# Altium project dankboard.PrjPcb
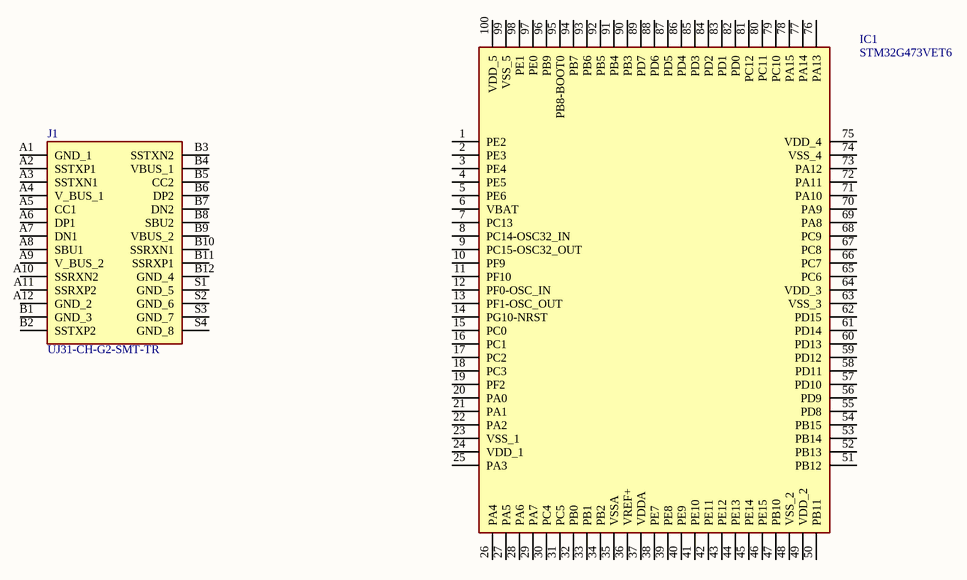
[diagram p0: dankboard.SchDoc]
3 sheets, 254 parts. Net scope: global (net labels, ports and power ports of the same name join across sheets).
Board file: dankboard.PcbDoc
Sheets:
  dankboard.SchDoc
  matrix.SchDoc
  rgb.SchDoc

## Sheet dankboard.SchDoc: dankboard - microcontroller
size A4; Author: Alexander Cafarella; CompanyName: Dank; DrawnBy: Alexander Cafarella; Engineer: Alexander Cafarella; SheetNumber: 1; SheetTotal: 3

### Parts
IC1  STM32G473VET6  [QFP50P1600X1600X160-100N]
J1  UJ31-CH-G2-SMT-TR  [UJ31CHG2SMTTR]

### Nets

Not connected (* = marked no-connect by the designer): IC1 1(PE2) 2(PE3) 3(PE4) 4(PE5) 5(PE6) 6(VBAT) 7(PC13) 8(PC14-OSC32_IN) 9(PC15-OSC32_OUT) 10(PF9) 11(PF10) 12(PF0-OSC_IN) 13(PF1-OSC_OUT) 14(PG10-NRST) 15(PC0) 16(PC1) 17(PC2) 18(PC3) 19(PF2) 20(PA0) 21(PA1) 22(PA2) 23(VSS_1) 24(VDD_1) 25(PA3) 26(PA4) 27(PA5) 28(PA6) 29(PA7) 30(PC4) 31(PC5) 32(PB0) 33(PB1) 34(PB2) 35(VSSA) 36(VREF+) 37(VDDA) 38(PE7) 39(PE8) 40(PE9) 41(PE10) 42(PE11) 43(PE12) 44(PE13) 45(PE14) 46(PE15) 47(PB10) 48(VSS_2) 49(VDD_2) 50(PB11) 51(PB12) 52(PB13) 53(PB14) 54(PB15) 55(PD8) 56(PD9) 57(PD10) 58(PD11) 59(PD12) 60(PD13) 61(PD14) 62(PD15) 63(VSS_3) 64(VDD_3) 65(PC6) 66(PC7) 67(PC8) 68(PC9) 69(PA8) 70(PA9) 71(PA10) 72(PA11) 73(PA12) 74(VSS_4) 75(VDD_4) 76(PA13) 77(PA14) 78(PA15) 79(PC10) 80(PC11) 81(PC12) 82(PD0) 83(PD1) 84(PD2) 85(PD3) 86(PD4) 87(PD5) 88(PD6) 89(PD7) 90(PB3) 91(PB4) 92(PB5) 93(PB6) 94(PB7) 95(PB8-BOOT0) 96(PB9) 97(PE0) 98(PE1) 99(VSS_5) 100(VDD_5); J1 A1(GND_1) A2(SSTXP1) A3(SSTXN1) A4(V_BUS_1) A5(CC1) A6(DP1) A7(DN1) A8(SBU1) A9(V_BUS_2) A10(SSRXN2) A11(SSRXP2) A12(GND_2) B1(GND_3) B2(SSTXP2) B3(SSTXN2) B4(VBUS_1) B5(CC2) B6(DP2) B7(DN2) B8(SBU2) B9(VBUS_2) B10(SSRXN1) B11(SSRXP1) B12(GND_4) S1(GND_5) S2(GND_6) S3(GND_7) S4(GND_8)

### Library data of the parts
IC1 = STM32G473VET6: Integrated Circuit; Manufacturer_Name: STMicroelectronics; Datasheet Link: https://www.st.com/resource/en/datasheet/stm32g473cb.pdf; Height: 1.6mm; Manufacturer_Part_Number: STM32G473VET6; Mouser Part Number: 511-STM32G473VET6; Mouser Price/Stock: https://www.mouser.co.uk/ProductDetail/STMicroelectronics/STM32G473VET6?qs=PzGy0jfpSMuOfCPr1WW9ZQ%3D%3D
J1 = UJ31-CH-G2-SMT-TR: Connector; Manufacturer_Name: CUI Devices; Datasheet Link: https://www.arrow.com/en/products/uj31-ch-g2-smt-tr/cui-devices; Height: 4.66mm; Manufacturer_Part_Number: UJ31-CH-G2-SMT-TR; Arrow Part Number: UJ31-CH-G2-SMT-TR; Arrow Price/Stock: https://www.arrow.com/en/products/uj31-ch-g2-smt-tr/cui-devices; Mouser Part Number: 490-UJ31-CH-G2SMT-TR; Mouser Price/Stock: https://www.mouser.co.uk/ProductDetail/CUI-Devices/UJ31-CH-G2-SMT-TR?qs=W0yvOO0ixfGEsh2EYrPgIQ%3D%3D

## Sheet matrix.SchDoc: Dankboard - Key Matrix
size 660 x 279 mm; Author: Alexander Cafarella; CompanyName: Dank; DrawnBy: Alexander Cafarella; Engineer: Alexander Cafarella; Organization: Dank; SheetNumber: 2; SheetTotal: 3
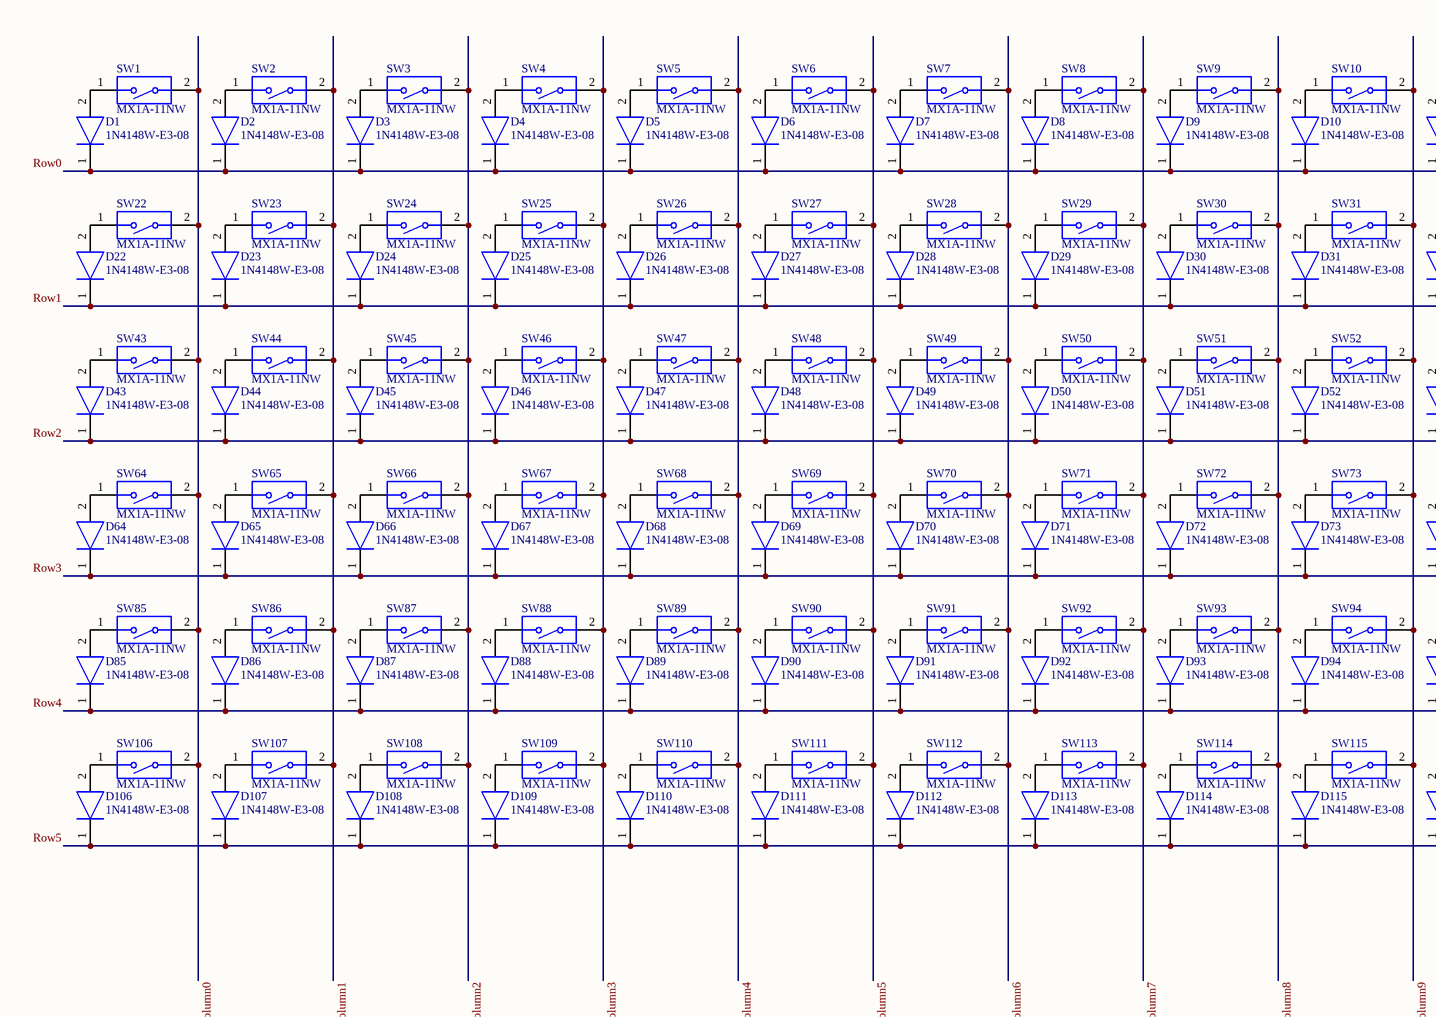
[diagram p1: matrix.SchDoc, left]
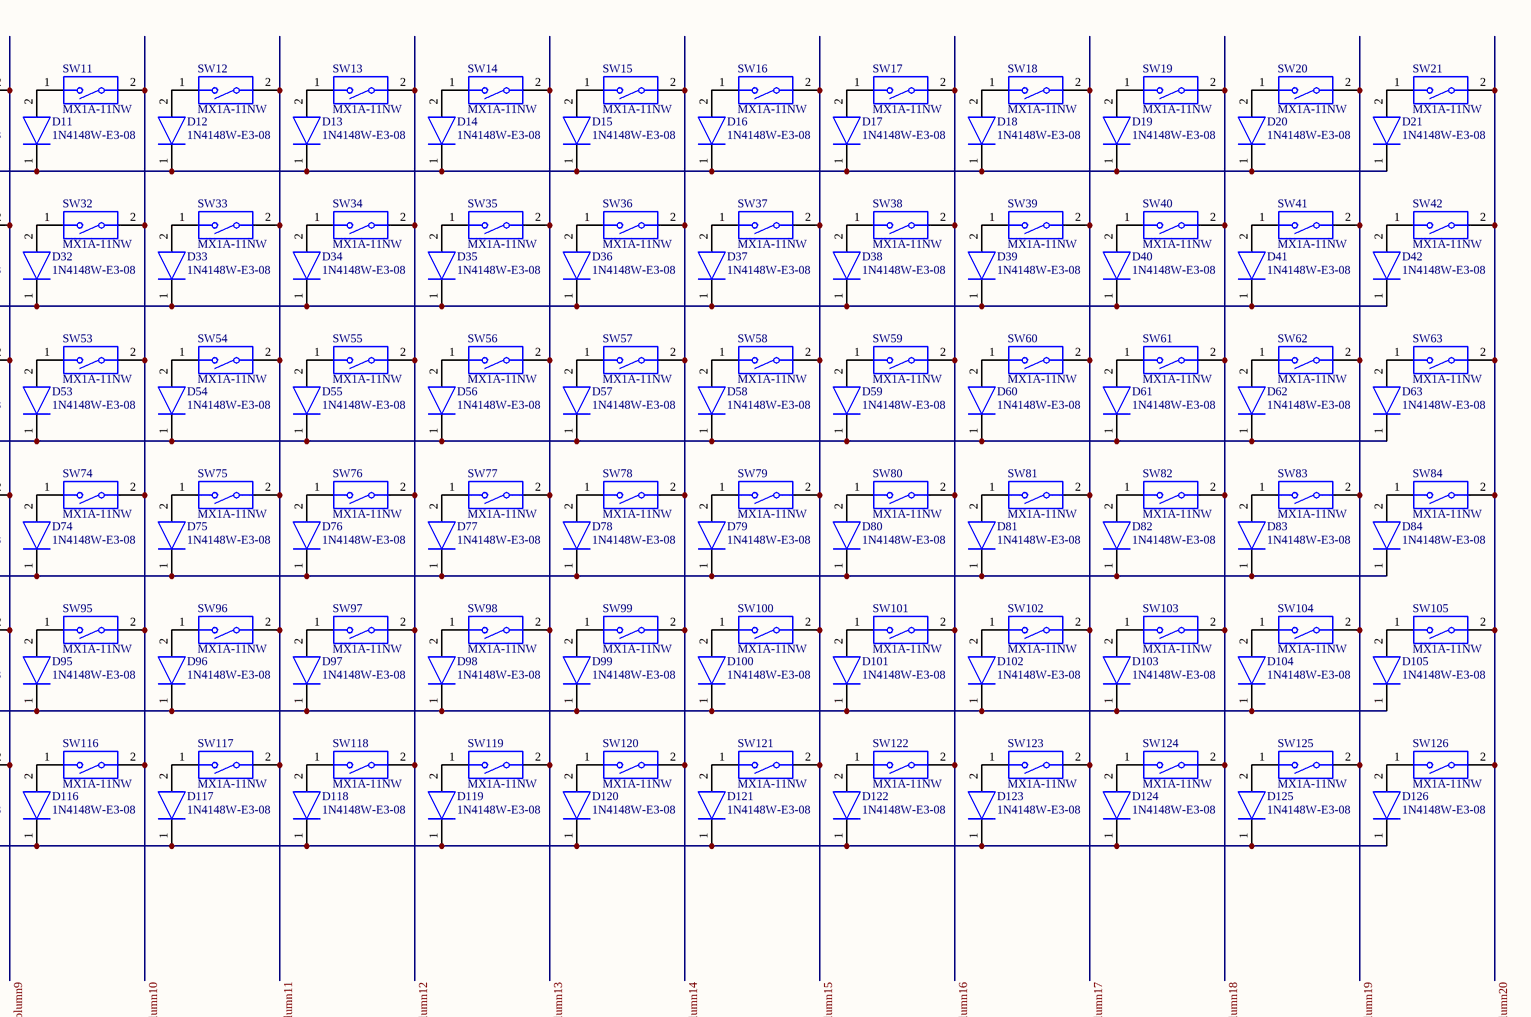
[diagram p2: matrix.SchDoc, right]

### Parts
D1  1N4148W-E3-08  [SOD3716X135N]
D2  1N4148W-E3-08  [SOD3716X135N]
D3  1N4148W-E3-08  [SOD3716X135N]
D4  1N4148W-E3-08  [SOD3716X135N]
D5  1N4148W-E3-08  [SOD3716X135N]
D6  1N4148W-E3-08  [SOD3716X135N]
D7  1N4148W-E3-08  [SOD3716X135N]
D8  1N4148W-E3-08  [SOD3716X135N]
D9  1N4148W-E3-08  [SOD3716X135N]
D10  1N4148W-E3-08  [SOD3716X135N]
D11  1N4148W-E3-08  [SOD3716X135N]
D12  1N4148W-E3-08  [SOD3716X135N]
D13  1N4148W-E3-08  [SOD3716X135N]
D14  1N4148W-E3-08  [SOD3716X135N]
D15  1N4148W-E3-08  [SOD3716X135N]
D16  1N4148W-E3-08  [SOD3716X135N]
D17  1N4148W-E3-08  [SOD3716X135N]
D18  1N4148W-E3-08  [SOD3716X135N]
D19  1N4148W-E3-08  [SOD3716X135N]
D20  1N4148W-E3-08  [SOD3716X135N]
D21  1N4148W-E3-08  [SOD3716X135N]
D22  1N4148W-E3-08  [SOD3716X135N]
D23  1N4148W-E3-08  [SOD3716X135N]
D24  1N4148W-E3-08  [SOD3716X135N]
D25  1N4148W-E3-08  [SOD3716X135N]
D26  1N4148W-E3-08  [SOD3716X135N]
D27  1N4148W-E3-08  [SOD3716X135N]
D28  1N4148W-E3-08  [SOD3716X135N]
D29  1N4148W-E3-08  [SOD3716X135N]
D30  1N4148W-E3-08  [SOD3716X135N]
D31  1N4148W-E3-08  [SOD3716X135N]
D32  1N4148W-E3-08  [SOD3716X135N]
D33  1N4148W-E3-08  [SOD3716X135N]
D34  1N4148W-E3-08  [SOD3716X135N]
D35  1N4148W-E3-08  [SOD3716X135N]
D36  1N4148W-E3-08  [SOD3716X135N]
D37  1N4148W-E3-08  [SOD3716X135N]
D38  1N4148W-E3-08  [SOD3716X135N]
D39  1N4148W-E3-08  [SOD3716X135N]
D40  1N4148W-E3-08  [SOD3716X135N]
D41  1N4148W-E3-08  [SOD3716X135N]
D42  1N4148W-E3-08  [SOD3716X135N]
D43  1N4148W-E3-08  [SOD3716X135N]
D44  1N4148W-E3-08  [SOD3716X135N]
D45  1N4148W-E3-08  [SOD3716X135N]
D46  1N4148W-E3-08  [SOD3716X135N]
D47  1N4148W-E3-08  [SOD3716X135N]
D48  1N4148W-E3-08  [SOD3716X135N]
D49  1N4148W-E3-08  [SOD3716X135N]
D50  1N4148W-E3-08  [SOD3716X135N]
D51  1N4148W-E3-08  [SOD3716X135N]
D52  1N4148W-E3-08  [SOD3716X135N]
D53  1N4148W-E3-08  [SOD3716X135N]
D54  1N4148W-E3-08  [SOD3716X135N]
D55  1N4148W-E3-08  [SOD3716X135N]
D56  1N4148W-E3-08  [SOD3716X135N]
D57  1N4148W-E3-08  [SOD3716X135N]
D58  1N4148W-E3-08  [SOD3716X135N]
D59  1N4148W-E3-08  [SOD3716X135N]
D60  1N4148W-E3-08  [SOD3716X135N]
D61  1N4148W-E3-08  [SOD3716X135N]
D62  1N4148W-E3-08  [SOD3716X135N]
D63  1N4148W-E3-08  [SOD3716X135N]
D64  1N4148W-E3-08  [SOD3716X135N]
D65  1N4148W-E3-08  [SOD3716X135N]
D66  1N4148W-E3-08  [SOD3716X135N]
D67  1N4148W-E3-08  [SOD3716X135N]
D68  1N4148W-E3-08  [SOD3716X135N]
D69  1N4148W-E3-08  [SOD3716X135N]
D70  1N4148W-E3-08  [SOD3716X135N]
D71  1N4148W-E3-08  [SOD3716X135N]
D72  1N4148W-E3-08  [SOD3716X135N]
D73  1N4148W-E3-08  [SOD3716X135N]
D74  1N4148W-E3-08  [SOD3716X135N]
D75  1N4148W-E3-08  [SOD3716X135N]
D76  1N4148W-E3-08  [SOD3716X135N]
D77  1N4148W-E3-08  [SOD3716X135N]
D78  1N4148W-E3-08  [SOD3716X135N]
D79  1N4148W-E3-08  [SOD3716X135N]
D80  1N4148W-E3-08  [SOD3716X135N]
D81  1N4148W-E3-08  [SOD3716X135N]
D82  1N4148W-E3-08  [SOD3716X135N]
D83  1N4148W-E3-08  [SOD3716X135N]
D84  1N4148W-E3-08  [SOD3716X135N]
D85  1N4148W-E3-08  [SOD3716X135N]
D86  1N4148W-E3-08  [SOD3716X135N]
D87  1N4148W-E3-08  [SOD3716X135N]
D88  1N4148W-E3-08  [SOD3716X135N]
D89  1N4148W-E3-08  [SOD3716X135N]
D90  1N4148W-E3-08  [SOD3716X135N]
D91  1N4148W-E3-08  [SOD3716X135N]
D92  1N4148W-E3-08  [SOD3716X135N]
D93  1N4148W-E3-08  [SOD3716X135N]
D94  1N4148W-E3-08  [SOD3716X135N]
D95  1N4148W-E3-08  [SOD3716X135N]
D96  1N4148W-E3-08  [SOD3716X135N]
D97  1N4148W-E3-08  [SOD3716X135N]
D98  1N4148W-E3-08  [SOD3716X135N]
D99  1N4148W-E3-08  [SOD3716X135N]
D100  1N4148W-E3-08  [SOD3716X135N]
D101  1N4148W-E3-08  [SOD3716X135N]
D102  1N4148W-E3-08  [SOD3716X135N]
D103  1N4148W-E3-08  [SOD3716X135N]
D104  1N4148W-E3-08  [SOD3716X135N]
D105  1N4148W-E3-08  [SOD3716X135N]
D106  1N4148W-E3-08  [SOD3716X135N]
D107  1N4148W-E3-08  [SOD3716X135N]
D108  1N4148W-E3-08  [SOD3716X135N]
D109  1N4148W-E3-08  [SOD3716X135N]
D110  1N4148W-E3-08  [SOD3716X135N]
D111  1N4148W-E3-08  [SOD3716X135N]
D112  1N4148W-E3-08  [SOD3716X135N]
D113  1N4148W-E3-08  [SOD3716X135N]
D114  1N4148W-E3-08  [SOD3716X135N]
D115  1N4148W-E3-08  [SOD3716X135N]
D116  1N4148W-E3-08  [SOD3716X135N]
D117  1N4148W-E3-08  [SOD3716X135N]
D118  1N4148W-E3-08  [SOD3716X135N]
D119  1N4148W-E3-08  [SOD3716X135N]
D120  1N4148W-E3-08  [SOD3716X135N]
D121  1N4148W-E3-08  [SOD3716X135N]
D122  1N4148W-E3-08  [SOD3716X135N]
D123  1N4148W-E3-08  [SOD3716X135N]
D124  1N4148W-E3-08  [SOD3716X135N]
D125  1N4148W-E3-08  [SOD3716X135N]
D126  1N4148W-E3-08  [SOD3716X135N]
SW1  MX1A-11NW  [CHRY-MX1A-11NW_V]
SW2  MX1A-11NW  [CHRY-MX1A-11NW_V]
SW3  MX1A-11NW  [CHRY-MX1A-11NW_V]
SW4  MX1A-11NW  [CHRY-MX1A-11NW_V]
SW5  MX1A-11NW  [CHRY-MX1A-11NW_V]
SW6  MX1A-11NW  [CHRY-MX1A-11NW_V]
SW7  MX1A-11NW  [CHRY-MX1A-11NW_V]
SW8  MX1A-11NW  [CHRY-MX1A-11NW_V]
SW9  MX1A-11NW  [CHRY-MX1A-11NW_V]
SW10  MX1A-11NW  [CHRY-MX1A-11NW_V]
SW11  MX1A-11NW  [CHRY-MX1A-11NW_V]
SW12  MX1A-11NW  [CHRY-MX1A-11NW_V]
SW13  MX1A-11NW  [CHRY-MX1A-11NW_V]
SW14  MX1A-11NW  [CHRY-MX1A-11NW_V]
SW15  MX1A-11NW  [CHRY-MX1A-11NW_V]
SW16  MX1A-11NW  [CHRY-MX1A-11NW_V]
SW17  MX1A-11NW  [CHRY-MX1A-11NW_V]
SW18  MX1A-11NW  [CHRY-MX1A-11NW_V]
SW19  MX1A-11NW  [CHRY-MX1A-11NW_V]
SW20  MX1A-11NW  [CHRY-MX1A-11NW_V]
SW21  MX1A-11NW  [CHRY-MX1A-11NW_V]
SW22  MX1A-11NW  [CHRY-MX1A-11NW_V]
SW23  MX1A-11NW  [CHRY-MX1A-11NW_V]
SW24  MX1A-11NW  [CHRY-MX1A-11NW_V]
SW25  MX1A-11NW  [CHRY-MX1A-11NW_V]
SW26  MX1A-11NW  [CHRY-MX1A-11NW_V]
SW27  MX1A-11NW  [CHRY-MX1A-11NW_V]
SW28  MX1A-11NW  [CHRY-MX1A-11NW_V]
SW29  MX1A-11NW  [CHRY-MX1A-11NW_V]
SW30  MX1A-11NW  [CHRY-MX1A-11NW_V]
SW31  MX1A-11NW  [CHRY-MX1A-11NW_V]
SW32  MX1A-11NW  [CHRY-MX1A-11NW_V]
SW33  MX1A-11NW  [CHRY-MX1A-11NW_V]
SW34  MX1A-11NW  [CHRY-MX1A-11NW_V]
SW35  MX1A-11NW  [CHRY-MX1A-11NW_V]
SW36  MX1A-11NW  [CHRY-MX1A-11NW_V]
SW37  MX1A-11NW  [CHRY-MX1A-11NW_V]
SW38  MX1A-11NW  [CHRY-MX1A-11NW_V]
SW39  MX1A-11NW  [CHRY-MX1A-11NW_V]
SW40  MX1A-11NW  [CHRY-MX1A-11NW_V]
SW41  MX1A-11NW  [CHRY-MX1A-11NW_V]
SW42  MX1A-11NW  [CHRY-MX1A-11NW_V]
SW43  MX1A-11NW  [CHRY-MX1A-11NW_V]
SW44  MX1A-11NW  [CHRY-MX1A-11NW_V]
SW45  MX1A-11NW  [CHRY-MX1A-11NW_V]
SW46  MX1A-11NW  [CHRY-MX1A-11NW_V]
SW47  MX1A-11NW  [CHRY-MX1A-11NW_V]
SW48  MX1A-11NW  [CHRY-MX1A-11NW_V]
SW49  MX1A-11NW  [CHRY-MX1A-11NW_V]
SW50  MX1A-11NW  [CHRY-MX1A-11NW_V]
SW51  MX1A-11NW  [CHRY-MX1A-11NW_V]
SW52  MX1A-11NW  [CHRY-MX1A-11NW_V]
SW53  MX1A-11NW  [CHRY-MX1A-11NW_V]
SW54  MX1A-11NW  [CHRY-MX1A-11NW_V]
SW55  MX1A-11NW  [CHRY-MX1A-11NW_V]
SW56  MX1A-11NW  [CHRY-MX1A-11NW_V]
SW57  MX1A-11NW  [CHRY-MX1A-11NW_V]
SW58  MX1A-11NW  [CHRY-MX1A-11NW_V]
SW59  MX1A-11NW  [CHRY-MX1A-11NW_V]
SW60  MX1A-11NW  [CHRY-MX1A-11NW_V]
SW61  MX1A-11NW  [CHRY-MX1A-11NW_V]
SW62  MX1A-11NW  [CHRY-MX1A-11NW_V]
SW63  MX1A-11NW  [CHRY-MX1A-11NW_V]
SW64  MX1A-11NW  [CHRY-MX1A-11NW_V]
SW65  MX1A-11NW  [CHRY-MX1A-11NW_V]
SW66  MX1A-11NW  [CHRY-MX1A-11NW_V]
SW67  MX1A-11NW  [CHRY-MX1A-11NW_V]
SW68  MX1A-11NW  [CHRY-MX1A-11NW_V]
SW69  MX1A-11NW  [CHRY-MX1A-11NW_V]
SW70  MX1A-11NW  [CHRY-MX1A-11NW_V]
SW71  MX1A-11NW  [CHRY-MX1A-11NW_V]
SW72  MX1A-11NW  [CHRY-MX1A-11NW_V]
SW73  MX1A-11NW  [CHRY-MX1A-11NW_V]
SW74  MX1A-11NW  [CHRY-MX1A-11NW_V]
SW75  MX1A-11NW  [CHRY-MX1A-11NW_V]
SW76  MX1A-11NW  [CHRY-MX1A-11NW_V]
SW77  MX1A-11NW  [CHRY-MX1A-11NW_V]
SW78  MX1A-11NW  [CHRY-MX1A-11NW_V]
SW79  MX1A-11NW  [CHRY-MX1A-11NW_V]
SW80  MX1A-11NW  [CHRY-MX1A-11NW_V]
SW81  MX1A-11NW  [CHRY-MX1A-11NW_V]
SW82  MX1A-11NW  [CHRY-MX1A-11NW_V]
SW83  MX1A-11NW  [CHRY-MX1A-11NW_V]
SW84  MX1A-11NW  [CHRY-MX1A-11NW_V]
SW85  MX1A-11NW  [CHRY-MX1A-11NW_V]
SW86  MX1A-11NW  [CHRY-MX1A-11NW_V]
SW87  MX1A-11NW  [CHRY-MX1A-11NW_V]
SW88  MX1A-11NW  [CHRY-MX1A-11NW_V]
SW89  MX1A-11NW  [CHRY-MX1A-11NW_V]
SW90  MX1A-11NW  [CHRY-MX1A-11NW_V]
SW91  MX1A-11NW  [CHRY-MX1A-11NW_V]
SW92  MX1A-11NW  [CHRY-MX1A-11NW_V]
SW93  MX1A-11NW  [CHRY-MX1A-11NW_V]
SW94  MX1A-11NW  [CHRY-MX1A-11NW_V]
SW95  MX1A-11NW  [CHRY-MX1A-11NW_V]
SW96  MX1A-11NW  [CHRY-MX1A-11NW_V]
SW97  MX1A-11NW  [CHRY-MX1A-11NW_V]
SW98  MX1A-11NW  [CHRY-MX1A-11NW_V]
SW99  MX1A-11NW  [CHRY-MX1A-11NW_V]
SW100  MX1A-11NW  [CHRY-MX1A-11NW_V]
SW101  MX1A-11NW  [CHRY-MX1A-11NW_V]
SW102  MX1A-11NW  [CHRY-MX1A-11NW_V]
SW103  MX1A-11NW  [CHRY-MX1A-11NW_V]
SW104  MX1A-11NW  [CHRY-MX1A-11NW_V]
SW105  MX1A-11NW  [CHRY-MX1A-11NW_V]
SW106  MX1A-11NW  [CHRY-MX1A-11NW_V]
SW107  MX1A-11NW  [CHRY-MX1A-11NW_V]
SW108  MX1A-11NW  [CHRY-MX1A-11NW_V]
SW109  MX1A-11NW  [CHRY-MX1A-11NW_V]
SW110  MX1A-11NW  [CHRY-MX1A-11NW_V]
SW111  MX1A-11NW  [CHRY-MX1A-11NW_V]
SW112  MX1A-11NW  [CHRY-MX1A-11NW_V]
SW113  MX1A-11NW  [CHRY-MX1A-11NW_V]
SW114  MX1A-11NW  [CHRY-MX1A-11NW_V]
SW115  MX1A-11NW  [CHRY-MX1A-11NW_V]
SW116  MX1A-11NW  [CHRY-MX1A-11NW_V]
SW117  MX1A-11NW  [CHRY-MX1A-11NW_V]
SW118  MX1A-11NW  [CHRY-MX1A-11NW_V]
SW119  MX1A-11NW  [CHRY-MX1A-11NW_V]
SW120  MX1A-11NW  [CHRY-MX1A-11NW_V]
SW121  MX1A-11NW  [CHRY-MX1A-11NW_V]
SW122  MX1A-11NW  [CHRY-MX1A-11NW_V]
SW123  MX1A-11NW  [CHRY-MX1A-11NW_V]
SW124  MX1A-11NW  [CHRY-MX1A-11NW_V]
SW125  MX1A-11NW  [CHRY-MX1A-11NW_V]
SW126  MX1A-11NW  [CHRY-MX1A-11NW_V]

### Nets
Column0: SW1.2 SW22.2 SW43.2 SW64.2 SW85.2 SW106.2
Column1: SW2.2 SW23.2 SW44.2 SW65.2 SW86.2 SW107.2
Column2: SW3.2 SW24.2 SW45.2 SW66.2 SW87.2 SW108.2
Column3: SW4.2 SW25.2 SW46.2 SW67.2 SW88.2 SW109.2
Column4: SW5.2 SW26.2 SW47.2 SW68.2 SW89.2 SW110.2
Column5: SW6.2 SW27.2 SW48.2 SW69.2 SW90.2 SW111.2
Column6: SW7.2 SW28.2 SW49.2 SW70.2 SW91.2 SW112.2
Column7: SW8.2 SW29.2 SW50.2 SW71.2 SW92.2 SW113.2
Column8: SW9.2 SW30.2 SW51.2 SW72.2 SW93.2 SW114.2
Column9: SW10.2 SW31.2 SW52.2 SW73.2 SW94.2 SW115.2
Column10: SW11.2 SW32.2 SW53.2 SW74.2 SW95.2 SW116.2
Column11: SW12.2 SW33.2 SW54.2 SW75.2 SW96.2 SW117.2
Column12: SW13.2 SW34.2 SW55.2 SW76.2 SW97.2 SW118.2
Column13: SW14.2 SW35.2 SW56.2 SW77.2 SW98.2 SW119.2
Column14: SW15.2 SW36.2 SW57.2 SW78.2 SW99.2 SW120.2
Column15: SW16.2 SW37.2 SW58.2 SW79.2 SW100.2 SW121.2
Column16: SW17.2 SW38.2 SW59.2 SW80.2 SW101.2 SW122.2
Column17: SW18.2 SW39.2 SW60.2 SW81.2 SW102.2 SW123.2
Column18: SW19.2 SW40.2 SW61.2 SW82.2 SW103.2 SW124.2
Column19: SW20.2 SW41.2 SW62.2 SW83.2 SW104.2 SW125.2
Column20: SW21.2 SW42.2 SW63.2 SW84.2 SW105.2 SW126.2
Row0: D1.1(K) D2.1(K) D3.1(K) D4.1(K) D5.1(K) D6.1(K) D7.1(K) D8.1(K) D9.1(K) D10.1(K) D11.1(K) D12.1(K) D13.1(K) D14.1(K) D15.1(K) D16.1(K) D17.1(K) D18.1(K) D19.1(K) D20.1(K) D21.1(K)
Row1: D22.1(K) D23.1(K) D24.1(K) D25.1(K) D26.1(K) D27.1(K) D28.1(K) D29.1(K) D30.1(K) D31.1(K) D32.1(K) D33.1(K) D34.1(K) D35.1(K) D36.1(K) D37.1(K) D38.1(K) D39.1(K) D40.1(K) D41.1(K) D42.1(K)
Row2: D43.1(K) D44.1(K) D45.1(K) D46.1(K) D47.1(K) D48.1(K) D49.1(K) D50.1(K) D51.1(K) D52.1(K) D53.1(K) D54.1(K) D55.1(K) D56.1(K) D57.1(K) D58.1(K) D59.1(K) D60.1(K) D61.1(K) D62.1(K) D63.1(K)
Row3: D64.1(K) D65.1(K) D66.1(K) D67.1(K) D68.1(K) D69.1(K) D70.1(K) D71.1(K) D72.1(K) D73.1(K) D74.1(K) D75.1(K) D76.1(K) D77.1(K) D78.1(K) D79.1(K) D80.1(K) D81.1(K) D82.1(K) D83.1(K) D84.1(K)
Row4: D85.1(K) D86.1(K) D87.1(K) D88.1(K) D89.1(K) D90.1(K) D91.1(K) D92.1(K) D93.1(K) D94.1(K) D95.1(K) D96.1(K) D97.1(K) D98.1(K) D99.1(K) D100.1(K) D101.1(K) D102.1(K) D103.1(K) D104.1(K) D105.1(K)
Row5: D106.1(K) D107.1(K) D108.1(K) D109.1(K) D110.1(K) D111.1(K) D112.1(K) D113.1(K) D114.1(K) D115.1(K) D116.1(K) D117.1(K) D118.1(K) D119.1(K) D120.1(K) D121.1(K) D122.1(K) D123.1(K) D124.1(K) D125.1(K) D126.1(K)
NetD1_2: D1.2(A) SW1.1
NetD2_2: D2.2(A) SW2.1
NetD3_2: D3.2(A) SW3.1
NetD4_2: D4.2(A) SW4.1
NetD5_2: D5.2(A) SW5.1
NetD6_2: D6.2(A) SW6.1
NetD7_2: D7.2(A) SW7.1
NetD8_2: D8.2(A) SW8.1
NetD9_2: D9.2(A) SW9.1
NetD10_2: D10.2(A) SW10.1
NetD11_2: D11.2(A) SW11.1
NetD12_2: D12.2(A) SW12.1
NetD13_2: D13.2(A) SW13.1
NetD14_2: D14.2(A) SW14.1
NetD15_2: D15.2(A) SW15.1
NetD16_2: D16.2(A) SW16.1
NetD17_2: D17.2(A) SW17.1
NetD18_2: D18.2(A) SW18.1
NetD19_2: D19.2(A) SW19.1
NetD20_2: D20.2(A) SW20.1
NetD21_2: D21.2(A) SW21.1
NetD22_2: D22.2(A) SW22.1
NetD23_2: D23.2(A) SW23.1
NetD24_2: D24.2(A) SW24.1
NetD25_2: D25.2(A) SW25.1
NetD26_2: D26.2(A) SW26.1
NetD27_2: D27.2(A) SW27.1
NetD28_2: D28.2(A) SW28.1
NetD29_2: D29.2(A) SW29.1
NetD30_2: D30.2(A) SW30.1
NetD31_2: D31.2(A) SW31.1
NetD32_2: D32.2(A) SW32.1
NetD33_2: D33.2(A) SW33.1
NetD34_2: D34.2(A) SW34.1
NetD35_2: D35.2(A) SW35.1
NetD36_2: D36.2(A) SW36.1
NetD37_2: D37.2(A) SW37.1
NetD38_2: D38.2(A) SW38.1
NetD39_2: D39.2(A) SW39.1
NetD40_2: D40.2(A) SW40.1
NetD41_2: D41.2(A) SW41.1
NetD42_2: D42.2(A) SW42.1
NetD43_2: D43.2(A) SW43.1
NetD44_2: D44.2(A) SW44.1
NetD45_2: D45.2(A) SW45.1
NetD46_2: D46.2(A) SW46.1
NetD47_2: D47.2(A) SW47.1
NetD48_2: D48.2(A) SW48.1
NetD49_2: D49.2(A) SW49.1
NetD50_2: D50.2(A) SW50.1
NetD51_2: D51.2(A) SW51.1
NetD52_2: D52.2(A) SW52.1
NetD53_2: D53.2(A) SW53.1
NetD54_2: D54.2(A) SW54.1
NetD55_2: D55.2(A) SW55.1
NetD56_2: D56.2(A) SW56.1
NetD57_2: D57.2(A) SW57.1
NetD58_2: D58.2(A) SW58.1
NetD59_2: D59.2(A) SW59.1
NetD60_2: D60.2(A) SW60.1
NetD61_2: D61.2(A) SW61.1
NetD62_2: D62.2(A) SW62.1
NetD63_2: D63.2(A) SW63.1
NetD64_2: D64.2(A) SW64.1
NetD65_2: D65.2(A) SW65.1
NetD66_2: D66.2(A) SW66.1
NetD67_2: D67.2(A) SW67.1
NetD68_2: D68.2(A) SW68.1
NetD69_2: D69.2(A) SW69.1
NetD70_2: D70.2(A) SW70.1
NetD71_2: D71.2(A) SW71.1
NetD72_2: D72.2(A) SW72.1
NetD73_2: D73.2(A) SW73.1
NetD74_2: D74.2(A) SW74.1
NetD75_2: D75.2(A) SW75.1
NetD76_2: D76.2(A) SW76.1
NetD77_2: D77.2(A) SW77.1
NetD78_2: D78.2(A) SW78.1
NetD79_2: D79.2(A) SW79.1
NetD80_2: D80.2(A) SW80.1
NetD81_2: D81.2(A) SW81.1
NetD82_2: D82.2(A) SW82.1
NetD83_2: D83.2(A) SW83.1
NetD84_2: D84.2(A) SW84.1
NetD85_2: D85.2(A) SW85.1
NetD86_2: D86.2(A) SW86.1
NetD87_2: D87.2(A) SW87.1
NetD88_2: D88.2(A) SW88.1
NetD89_2: D89.2(A) SW89.1
NetD90_2: D90.2(A) SW90.1
NetD91_2: D91.2(A) SW91.1
NetD92_2: D92.2(A) SW92.1
NetD93_2: D93.2(A) SW93.1
NetD94_2: D94.2(A) SW94.1
NetD95_2: D95.2(A) SW95.1
NetD96_2: D96.2(A) SW96.1
NetD97_2: D97.2(A) SW97.1
NetD98_2: D98.2(A) SW98.1
NetD99_2: D99.2(A) SW99.1
NetD100_2: D100.2(A) SW100.1
NetD101_2: D101.2(A) SW101.1
NetD102_2: D102.2(A) SW102.1
NetD103_2: D103.2(A) SW103.1
NetD104_2: D104.2(A) SW104.1
NetD105_2: D105.2(A) SW105.1
NetD106_2: D106.2(A) SW106.1
NetD107_2: D107.2(A) SW107.1
NetD108_2: D108.2(A) SW108.1
NetD109_2: D109.2(A) SW109.1
NetD110_2: D110.2(A) SW110.1
NetD111_2: D111.2(A) SW111.1
NetD112_2: D112.2(A) SW112.1
NetD113_2: D113.2(A) SW113.1
NetD114_2: D114.2(A) SW114.1
NetD115_2: D115.2(A) SW115.1
NetD116_2: D116.2(A) SW116.1
NetD117_2: D117.2(A) SW117.1
NetD118_2: D118.2(A) SW118.1
NetD119_2: D119.2(A) SW119.1
NetD120_2: D120.2(A) SW120.1
NetD121_2: D121.2(A) SW121.1
NetD122_2: D122.2(A) SW122.1
NetD123_2: D123.2(A) SW123.1
NetD124_2: D124.2(A) SW124.1
NetD125_2: D125.2(A) SW125.1
NetD126_2: D126.2(A) SW126.1

### Library data of the parts
D1-D126 = 1N4148W-E3-08: Diode; Manufacturer_Name: Vishay; Datasheet Link: http://www.vishay.com/docs/85748/1n4148w.pdf; Height: 1.35mm; Manufacturer_Part_Number: 1N4148W-E3-08; Arrow Part Number: 1N4148W-E3-08; Arrow Price/Stock: https://www.arrow.com/en/products/1n4148w-e3-08/vishay; Mouser Part Number: 78-1N4148W-E3-08; Mouser Price/Stock: https://www.mouser.co.uk/ProductDetail/Vishay-Semiconductors/1N4148W-E3-08?qs=bTzheeSci6TVjpxfjjRVMw%3D%3D
SW1-SW126 = CMP-2000-06786-1: Keylock Switch, 12 V, -10 to 70 degC, 2-Pin THD, RoHS, Bulk; Manufacturer: Cherry; Part No: MX1A11NW; Maximum DC Voltage Rating: 12V; COO: UK; Row Spacing: 6.35mm; Pole Throw Configuration: SPST; Total Travel: 4.06mm; Illumination Type: N/R; Actuator Style: Button; Operating Force: 0.58N; Electrical Life: 50000000Cycle; Minimum Insulation Resistance: 100MOhm; Body Orientation: Straight; Actuator Length: 3.6mm; Switch Configuration: N.O.; Maximum Current Rating: 0.01A; Maximum Contact Resistance: 200mOhm; Actuator Color: N/A; Terminal Type: PCPins; Operating Temperature: -10to70C; Number of Terminals: 2; Operating Speed: N/A; Maximum AC Voltage Rating: 12V; Housing Material: N/A; Datasheet URL: https://cdn.sparkfun.com/datasheets/Components/Switches/MX%20Series.pdf; Type: DesktopProfile; Terminal Pitch: 2.54mm; Package Reference: MX1A-11NW; ECCN: EAR99; Family: MX; Packaging: N/A; HTS: 8536509065; Actuator Material: N/A; Package Description: 2-Pin Through Hole Device, Body 15.6 x 15.6 mm; Dielectric Strength: N/A; Illumination Color: N/R; Manufacturer URL: http://cherryswitches.com/cn/; Dimension: 15.6x15.6x15.2mm; Mechanical Life: N/A; RoHS: Unknown; Contact Plating: N/A; Supplier: CherryElectrical; Contact Material: Silver/Gold; IP Rating: N/A; Mounting: ThroughHole; Datasheet Version: 09/2000; Maximum Power Rating: N/A; Mounting Technology: ThroughHole

## Sheet rgb.SchDoc: Dankboard - RGB
size A4; Author: Alexander Cafarella; CompanyName: Dank; DrawnBy: Alexander Cafarella; Engineer: Alexander Cafarella; Organization: Dank; SheetNumber: 3; SheetTotal: 3